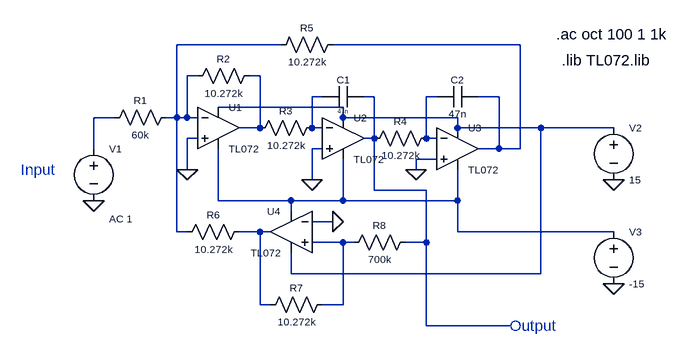
[diagram p0: schematic Bandpass for E4.asc]
Bandpass for E4.asc, the LTspice schematic file:
Version 4.1
SHEET 1 1088 680
WIRE 320 16 160 16
WIRE 688 16 400 16
WIRE 192 64 176 64
WIRE 288 64 272 64
WIRE 384 96 368 96
WIRE 464 96 448 96
WIRE 560 96 544 96
WIRE 656 96 624 96
WIRE 416 112 224 112
WIRE 64 128 32 128
WIRE 160 128 160 16
WIRE 160 128 144 128
WIRE 176 128 176 64
WIRE 176 128 160 128
WIRE 192 128 176 128
WIRE 416 128 416 112
WIRE 592 128 416 128
WIRE 288 144 288 64
WIRE 288 144 256 144
WIRE 368 144 368 96
WIRE 384 144 368 144
WIRE 592 144 592 128
WIRE 720 144 592 144
WIRE 832 144 720 144
WIRE 192 160 176 160
WIRE 464 160 464 96
WIRE 464 160 448 160
WIRE 544 160 544 96
WIRE 560 160 544 160
WIRE 32 176 32 128
WIRE 384 176 368 176
WIRE 656 176 656 96
WIRE 656 176 624 176
WIRE 688 176 688 16
WIRE 688 176 656 176
WIRE 560 192 528 192
WIRE 176 208 176 160
WIRE 528 208 528 192
WIRE 368 224 368 176
WIRE 464 240 464 160
WIRE 544 240 464 240
WIRE 224 256 224 176
WIRE 336 256 224 256
WIRE 416 256 416 192
WIRE 416 256 336 256
WIRE 592 256 592 208
WIRE 592 256 416 256
WIRE 336 272 336 256
WIRE 400 288 368 288
WIRE 160 304 160 128
WIRE 176 304 160 304
WIRE 288 304 256 304
WIRE 304 304 288 304
WIRE 592 304 592 256
WIRE 832 304 592 304
WIRE 416 320 368 320
WIRE 432 320 416 320
WIRE 544 320 544 240
WIRE 544 320 512 320
WIRE 336 368 336 336
WIRE 720 368 720 144
WIRE 720 368 336 368
WIRE 288 416 288 304
WIRE 304 416 288 416
WIRE 416 416 416 320
WIRE 416 416 384 416
WIRE 544 448 544 320
WIRE 672 448 544 448
FLAG 176 208 0
FLAG 368 224 0
FLAG 528 208 0
FLAG 400 288 0
FLAG 32 256 0
FLAG 832 224 0
FLAG 832 384 0
SYMBOL res 160 112 R90
WINDOW 0 0 56 VBottom 1
WINDOW 3 32 56 VTop 1
SYMATTR InstName R1
SYMATTR Value 60k
SYMBOL res 288 48 R90
WINDOW 0 0 56 VBottom 1
WINDOW 3 32 56 VTop 1
SYMATTR InstName R2
SYMATTR Value 10.272k
SYMBOL res 384 128 R90
WINDOW 0 0 56 VBottom 1
WINDOW 3 32 56 VTop 1
SYMATTR InstName R3
SYMATTR Value 10.272k
SYMBOL res 560 144 R90
WINDOW 0 0 56 VBottom 1
WINDOW 3 32 56 VTop 1
SYMATTR InstName R4
SYMATTR Value 10.272k
SYMBOL res 416 0 R90
WINDOW 0 0 56 VBottom 1
WINDOW 3 32 56 VTop 1
SYMATTR InstName R5
SYMATTR Value 10.272k
SYMBOL res 272 288 R90
WINDOW 0 0 56 VBottom 1
WINDOW 3 32 56 VTop 1
SYMATTR InstName R6
SYMATTR Value 10.272k
SYMBOL res 528 304 R90
WINDOW 0 0 56 VBottom 1
WINDOW 3 32 56 VTop 1
SYMATTR InstName R8
SYMATTR Value 700k
SYMBOL cap 448 80 R90
WINDOW 0 0 32 VBottom 1
WINDOW 3 32 32 VTop 0
SYMATTR InstName C1
SYMATTR Value 47n
SYMBOL cap 624 80 R90
WINDOW 0 0 32 VBottom 1
WINDOW 3 32 32 VTop 1
SYMATTR InstName C2
SYMATTR Value 47n
SYMBOL res 400 400 R90
WINDOW 0 0 56 VBottom 1
WINDOW 3 32 56 VTop 1
SYMATTR InstName R7
SYMATTR Value 10.272k
SYMBOL voltage 32 160 R0
WINDOW 123 24 124 Left 1
WINDOW 39 0 0 Left 0
WINDOW 0 24 16 Left 1
SYMATTR Value2 AC 1
SYMATTR InstName V1
SYMATTR Value ""
SYMBOL voltage 832 128 R0
WINDOW 123 0 0 Left 0
WINDOW 39 0 0 Left 0
WINDOW 0 24 16 Left 1
WINDOW 3 24 96 Left 1
SYMATTR InstName V2
SYMATTR Value 15
SYMBOL voltage 832 288 R0
WINDOW 123 0 0 Left 0
WINDOW 39 0 0 Left 0
WINDOW 0 24 16 Left 1
WINDOW 3 24 96 Left 1
SYMATTR InstName V3
SYMATTR Value -15
SYMBOL OpAmps\\opamp2 224 80 R0
WINDOW 0 16 32 Left 1
WINDOW 3 16 96 Left 1
SYMATTR InstName U1
SYMATTR Value TL072
SYMBOL OpAmps\\opamp2 416 96 R0
WINDOW 0 16 32 Left 1
WINDOW 3 16 96 Left 1
SYMATTR InstName U2
SYMATTR Value TL072
SYMBOL OpAmps\\opamp2 592 112 R0
WINDOW 0 16 32 Left 1
WINDOW 3 16 96 Left 1
SYMATTR InstName U3
SYMATTR Value TL072
SYMBOL OpAmps\\opamp2 336 240 M0
WINDOW 0 16 32 Left 1
WINDOW 3 16 96 Left 1
SYMATTR InstName U4
SYMATTR Value TL072
TEXT 744 0 Left 2 !.ac oct 100 1 1k
TEXT 672 448 Left 2 ;Output
TEXT -80 208 Left 2 ;Input
TEXT 752 40 Left 2 !.lib TL072.lib

The netlist it stands for:
* Bandpass for E4.asc
R1 N001 N008 60k
R2 N003 N001 10.272k
R3 N004 N003 10.272k
R4 N006 N005 10.272k
R5 N002 N001 10.272k
R6 N010 N001 10.272k
R8 N005 N011 700k
C1 N005 N004 47n
C2 N002 N006 47n
R7 N011 N010 10.272k
V1 N008 0 AC 1
V2 N007 0 15
V3 N009 0 -15
X§U1 0 N001 N007 N009 N003 TL072  ; pins In+ In- V+ V- OUT
X§U2 0 N004 N007 N009 N005 TL072  ; pins In+ In- V+ V- OUT
X§U3 0 N006 N007 N009 N002 TL072  ; pins In+ In- V+ V- OUT
X§U4 N011 0 N009 N007 N010 TL072  ; pins In+ In- V+ V- OUT
.ac oct 100 1 1k
* Output
* Input
.lib TL072.lib
.backanno
.end